# Altium schematic sheet yandex_test.SchDoc
size A4
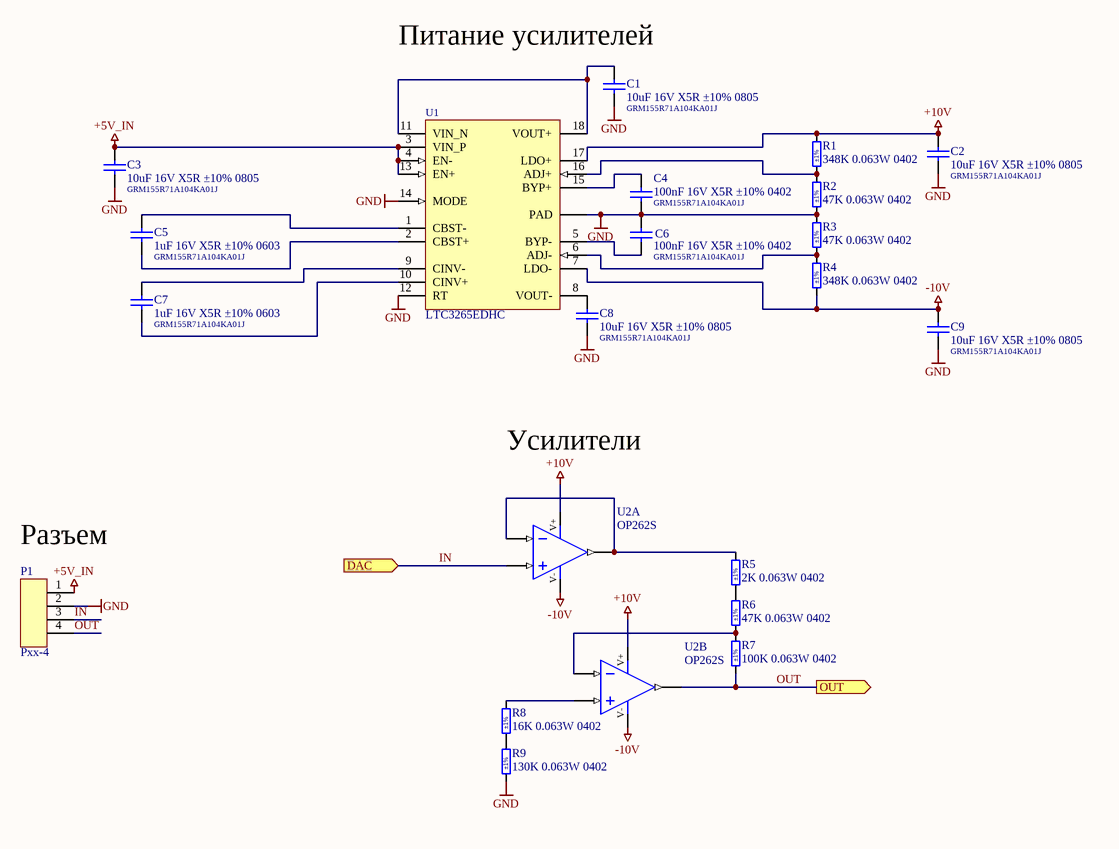
[diagram p0: yandex_test.SchDoc]

## Parts
C1  10uF 16V X5R ±10% 0805  Name: GRM155R71A104KA01J  [0805]
C2  10uF 16V X5R ±10% 0805  Name: GRM155R71A104KA01J  [0805]
C3  10uF 16V X5R ±10% 0805  Name: GRM155R71A104KA01J  [0805]
C4  100nF 16V X5R ±10% 0402  Name: GRM155R71A104KA01J  [0402]
C5  1uF 16V X5R ±10% 0603  Name: GRM155R71A104KA01J  [0603]
C6  100nF 16V X5R ±10% 0402  Name: GRM155R71A104KA01J  [0402]
C7  1uF 16V X5R ±10% 0603  Name: GRM155R71A104KA01J  [0603]
C8  10uF 16V X5R ±10% 0805  Name: GRM155R71A104KA01J  [0805]
C9  10uF 16V X5R ±10% 0805  Name: GRM155R71A104KA01J  [0805]
P1  Pxx-4  [PBD4_2.54]
R1  348K 0.063W 0402  [0402]
R2  47K 0.063W 0402  [0402]
R3  47K 0.063W 0402  [0402]
R4  348K 0.063W 0402  [0402]
R5  2K 0.063W 0402  [0402]
R6  47K 0.063W 0402  [0402]
R7  100K 0.063W 0402  [0402]
R8  16K 0.063W 0402  [0402]
R9  130K 0.063W 0402  [0402]
U1  LTC3265EDHC
U2A  OP262S  [UFLGA6]
U2B  OP262S  [UFLGA6]

## Ports
DAC (in), OUT (out)

## Nets
+5V_IN: C3.1 P1.1 U1.3(VIN_P) U1.4(EN-) U1.13(EN+)
+10V: C2.1 R1.2 U1.17(LDO+) U2A.6(V+) U2B.6(V+)
-10V: C9.1 R4.1 U1.7(LDO-) U2A.2(V-) U2B.2(V-)
GND: C1.2 C2.2 C3.2 C4.2 C6.1 C8.2 C9.2 P1.2 R2.1 R3.2 R9.1 U1.12(RT) U1.14(MODE) U1.19(PAD)
IN: P1.3 U2A.3(IN+) ; port DAC
OUT: P1.4 R7.1 U2B.1(OUT) ; port OUT
NetC1_1: C1.1 U1.11(VIN_N) U1.18(VOUT+)
NetC4_1: C4.1 U1.15(BYP+)
NetC5_1: C5.1 U1.1(CBST-)
NetC5_2: C5.2 U1.2(CBST+)
NetC6_2: C6.2 U1.5(BYP-)
NetC7_1: C7.1 U1.9(CINV-)
NetC7_2: C7.2 U1.10(CINV+)
NetC8_1: C8.1 U1.8(VOUT-)
NetR1_1: R1.1 R2.2 U1.16(ADJ+)
NetR3_1: R3.1 R4.2 U1.6(ADJ-)
NetR5_1: R5.1 R6.2
NetR5_2: R5.2 U2A.1(OUT) U2A.4(IN-)
NetR6_1: R6.1 R7.2 U2B.4(IN-)
NetR8_1: R8.1 R9.2
NetR8_2: R8.2 U2B.3(IN+)

## Notes on the sheet
- (near C1) Питание усилителей
- Усилители
- (near P1) Разъем

## Library data of the parts
C1-C9 = Capacitor ceramic: Ceramic capacitor; Manufacturer: Murata; Voltage: 16V; Tolerance: ±10%; Dielectric: X5R; BOMString: =Capacitance+' '+Voltage+' '+Tolerance+' '+Footprint; HelpURL: *; Supplier: *
  C1-C3 C8 C9: Capacitance: 10uF
  C4 C6: Capacitance: 100nF
  C5 C7: Capacitance: 1uF
R1-R9 = Resistor: Thin Film Chip Resistor; Manufacturer: Samsung; Tolerance: ±1%; Name: RC1005J102CS; Power: 0.063W; Supplier: *; HelpURL: *; BOMString: =Resistance+' '+Tolerance+' '+Power+' '+Footprint
  R1 R4: Resistance: 348K
  R2 R3 R6: Resistance: 47K
  R5: Resistance: 2K
  R7: Resistance: 100K
  R8: Resistance: 16K
  R9: Resistance: 130K
U1 = LTC3265: Low Noise Dual Supply / with Boost and Inverting / Charge Pumps; Name: LTC3265EDHC
U2A U2B = OPAMP: Rail to rail opamp; HelpURL: https://www.mouser.com/datasheet/2/268/21733h-26779.pdf; Supplier: https://www.chipdip.ru/product/mcp6001rt-i-ot-microchip; Price(1): 0.64; Price(100): 0.40170